# Altium schematic sheet Schematic.SchDoc
size B; SheetNumber: 1; SheetTotal: 2
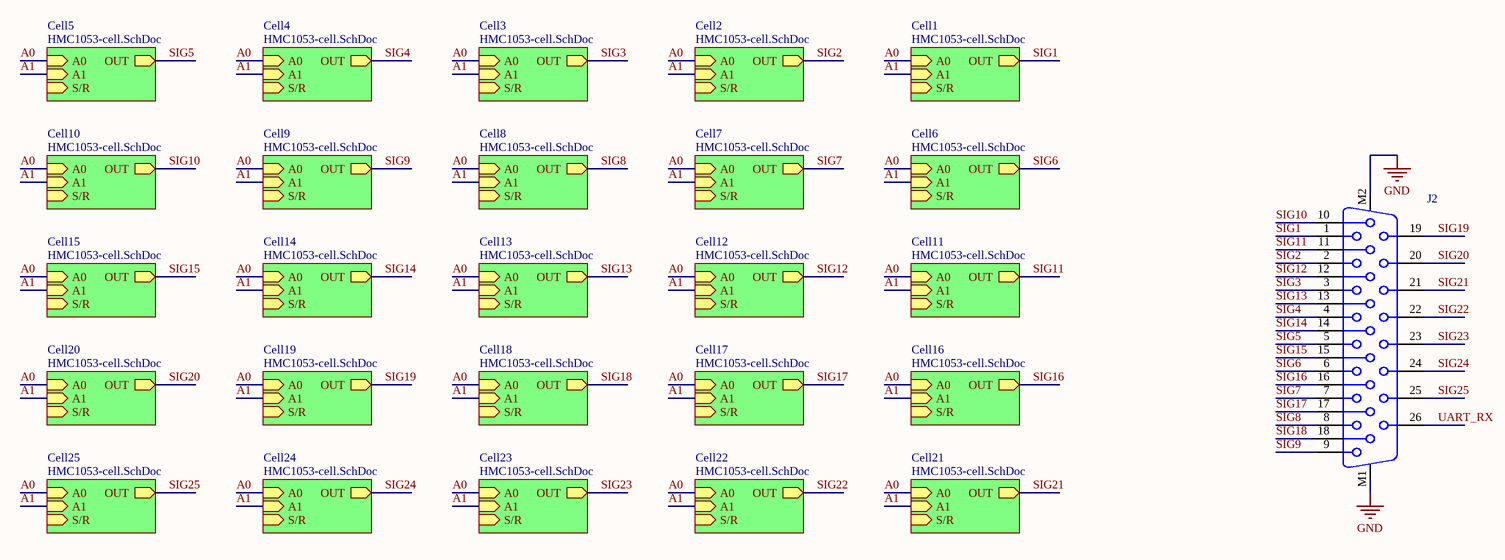
[diagram p0: Schematic.SchDoc]

## Parts
J2  D-sub_26  [D-sub_26]  (value not drawn)

## Sub-sheets
Cell1 = HMC1053-cell.SchDoc: OUT (out), A0 (in), A1 (in), S/R (in)
Cell2 = HMC1053-cell.SchDoc: OUT (out), A0 (in), A1 (in), S/R (in)
Cell3 = HMC1053-cell.SchDoc: OUT (out), A0 (in), A1 (in), S/R (in)
Cell4 = HMC1053-cell.SchDoc: OUT (out), A0 (in), A1 (in), S/R (in)
Cell5 = HMC1053-cell.SchDoc: OUT (out), A0 (in), A1 (in), S/R (in)
Cell6 = HMC1053-cell.SchDoc: OUT (out), A0 (in), A1 (in), S/R (in)
Cell7 = HMC1053-cell.SchDoc: OUT (out), A0 (in), A1 (in), S/R (in)
Cell8 = HMC1053-cell.SchDoc: OUT (out), A0 (in), A1 (in), S/R (in)
Cell9 = HMC1053-cell.SchDoc: OUT (out), A0 (in), A1 (in), S/R (in)
Cell10 = HMC1053-cell.SchDoc: OUT (out), A0 (in), A1 (in), S/R (in)
Cell11 = HMC1053-cell.SchDoc: OUT (out), A0 (in), A1 (in), S/R (in)
Cell12 = HMC1053-cell.SchDoc: OUT (out), A0 (in), A1 (in), S/R (in)
Cell13 = HMC1053-cell.SchDoc: OUT (out), A0 (in), A1 (in), S/R (in)
Cell14 = HMC1053-cell.SchDoc: OUT (out), A0 (in), A1 (in), S/R (in)
Cell15 = HMC1053-cell.SchDoc: OUT (out), A0 (in), A1 (in), S/R (in)
Cell16 = HMC1053-cell.SchDoc: OUT (out), A0 (in), A1 (in), S/R (in)
Cell17 = HMC1053-cell.SchDoc: OUT (out), A0 (in), A1 (in), S/R (in)
Cell18 = HMC1053-cell.SchDoc: OUT (out), A0 (in), A1 (in), S/R (in)
Cell19 = HMC1053-cell.SchDoc: OUT (out), A0 (in), A1 (in), S/R (in)
Cell20 = HMC1053-cell.SchDoc: OUT (out), A0 (in), A1 (in), S/R (in)
Cell21 = HMC1053-cell.SchDoc: OUT (out), A0 (in), A1 (in), S/R (in)
Cell22 = HMC1053-cell.SchDoc: OUT (out), A0 (in), A1 (in), S/R (in)
Cell23 = HMC1053-cell.SchDoc: OUT (out), A0 (in), A1 (in), S/R (in)
Cell24 = HMC1053-cell.SchDoc: OUT (out), A0 (in), A1 (in), S/R (in)
Cell25 = HMC1053-cell.SchDoc: OUT (out), A0 (in), A1 (in), S/R (in)

## Nets
GND: J2.M1 J2.M2
A0: sheet Cell1/A0, sheet Cell2/A0, sheet Cell3/A0, sheet Cell4/A0, sheet Cell5/A0, sheet Cell6/A0, sheet Cell7/A0, sheet Cell8/A0, sheet Cell9/A0, sheet Cell10/A0, sheet Cell11/A0, sheet Cell12/A0, sheet Cell13/A0, sheet Cell14/A0, sheet Cell15/A0, sheet Cell16/A0, sheet Cell17/A0, sheet Cell18/A0, sheet Cell19/A0, sheet Cell20/A0, sheet Cell21/A0, sheet Cell22/A0, sheet Cell23/A0, sheet Cell24/A0, sheet Cell25/A0
A1: sheet Cell1/A1, sheet Cell2/A1, sheet Cell3/A1, sheet Cell4/A1, sheet Cell5/A1, sheet Cell6/A1, sheet Cell7/A1, sheet Cell8/A1, sheet Cell9/A1, sheet Cell10/A1, sheet Cell11/A1, sheet Cell12/A1, sheet Cell13/A1, sheet Cell14/A1, sheet Cell15/A1, sheet Cell16/A1, sheet Cell17/A1, sheet Cell18/A1, sheet Cell19/A1, sheet Cell20/A1, sheet Cell21/A1, sheet Cell22/A1, sheet Cell23/A1, sheet Cell24/A1, sheet Cell25/A1
SIG1: J2.1 ; sheet Cell1/OUT
SIG2: J2.2 ; sheet Cell2/OUT
SIG3: J2.3 ; sheet Cell3/OUT
SIG4: J2.4 ; sheet Cell4/OUT
SIG5: J2.5 ; sheet Cell5/OUT
SIG6: J2.6 ; sheet Cell6/OUT
SIG7: J2.7 ; sheet Cell7/OUT
SIG8: J2.8 ; sheet Cell8/OUT
SIG9: J2.9 ; sheet Cell9/OUT
SIG10: J2.10 ; sheet Cell10/OUT
SIG11: J2.11 ; sheet Cell11/OUT
SIG12: J2.12 ; sheet Cell12/OUT
SIG13: J2.13 ; sheet Cell13/OUT
SIG14: J2.14 ; sheet Cell14/OUT
SIG15: J2.15 ; sheet Cell15/OUT
SIG16: J2.16 ; sheet Cell16/OUT
SIG17: J2.17 ; sheet Cell17/OUT
SIG18: J2.18 ; sheet Cell18/OUT
SIG19: J2.19 ; sheet Cell19/OUT
SIG20: J2.20 ; sheet Cell20/OUT
SIG21: J2.21 ; sheet Cell21/OUT
SIG22: J2.22 ; sheet Cell22/OUT
SIG23: J2.23 ; sheet Cell23/OUT
SIG24: J2.24 ; sheet Cell24/OUT
SIG25: J2.25 ; sheet Cell25/OUT
UART_RX: J2.26

## Library data of the parts
J2 = D-sub_26: Female High Density PCB Connector with Hex Screw WR-DSUB, Angled, 26 pins; Manufacturer: Wurth Elektronik; Part Number: 618026330923; Working Voltage: 60VAC; Pin Number: 26; Contact Resistance: 30mOhm; Rated Current: 3A; Gender: Female; Packaging: Tray; Datasheet URL: https://katalog.we-online.de/em/datasheet/6180xx330923.pdf; Package Reference: 618026330923; Publisher: WurthElektronik; Orientation: Angled; Manufacturer URL: http://www.we-online.de; Operating Temperature: -40to85degC; Mounting Technology: THT